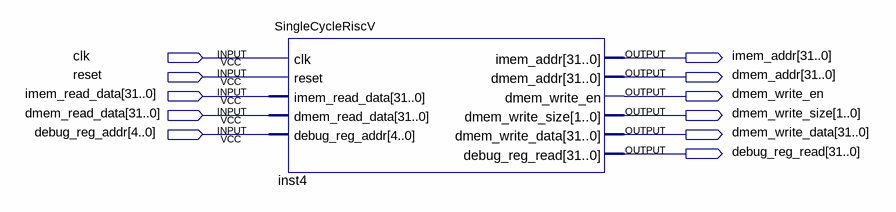
[diagram p0: schematic sheet]
// Quartus schematic toy_risc_v_top.bdf as structural Verilog: 1 symbols, 11 pins
module toy_risc_v_top (
  input  clk,
  input  reset,
  input  [31:0] imem_read_data,
  input  [31:0] dmem_read_data,
  input  [4:0] debug_reg_addr,
  output [31:0] imem_addr,
  output [31:0] dmem_addr,
  output dmem_write_en,
  output [1:0] dmem_write_size,
  output [31:0] dmem_write_data,
  output [31:0] debug_reg_read
);

  SingleCycleRiscV inst4 (
    .clk(clk), .reset(reset), .imem_read_data(imem_read_data), .dmem_read_data(dmem_read_data),
    .debug_reg_addr(debug_reg_addr), .imem_addr(imem_addr), .dmem_addr(dmem_addr),
    .dmem_write_en(dmem_write_en), .dmem_write_size(dmem_write_size), .dmem_write_data(dmem_write_data),
    .debug_reg_read(debug_reg_read));
endmodule
